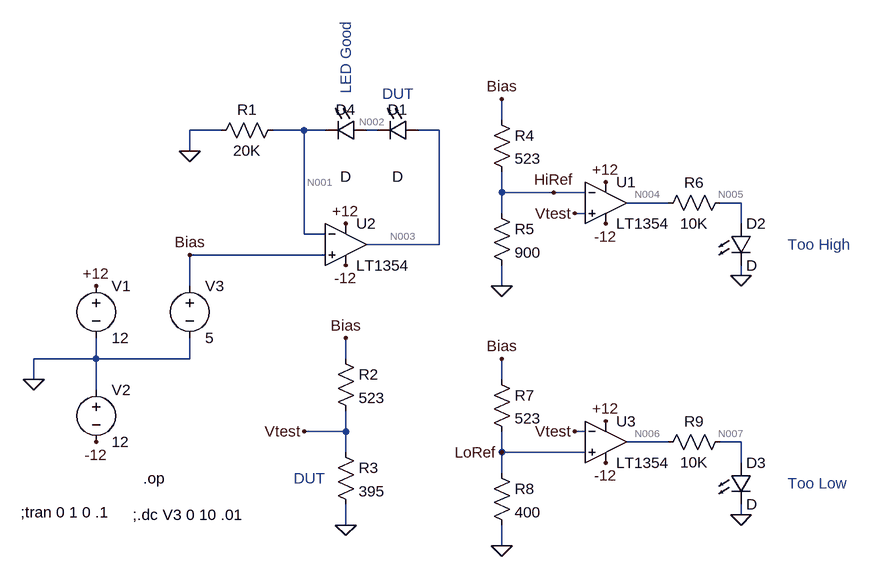
[diagram p0: schematic vactrol_test_rig.asc]
vactrol_test_rig.asc, the LTspice schematic file:
Version 4
SHEET 1 1456 680
WIRE 576 -224 576 -256
WIRE 144 -208 96 -208
WIRE 272 -208 224 -208
WIRE 304 -208 272 -208
WIRE 384 -208 368 -208
WIRE 480 -208 448 -208
WIRE 96 -176 96 -208
WIRE 576 -112 576 -144
WIRE 656 -112 576 -112
WIRE 704 -112 656 -112
WIRE 832 -96 768 -96
WIRE 944 -96 912 -96
WIRE 576 -80 576 -112
WIRE 704 -80 688 -80
WIRE 944 -64 944 -96
WIRE 272 -48 272 -208
WIRE 304 -48 272 -48
WIRE 480 -32 480 -208
WIRE 480 -32 368 -32
WIRE 304 -16 96 -16
WIRE 944 16 944 0
WIRE 96 32 96 -16
WIRE 576 32 576 0
WIRE -48 144 -48 112
WIRE -48 144 -144 144
WIRE 96 144 96 112
WIRE 96 144 -48 144
WIRE 336 144 336 112
WIRE -144 176 -144 144
WIRE 576 176 576 144
WIRE -48 192 -48 144
WIRE 336 256 336 224
WIRE 336 256 272 256
WIRE 704 256 688 256
WIRE 832 272 768 272
WIRE 944 272 912 272
WIRE 336 288 336 256
WIRE 576 288 576 256
WIRE 704 288 576 288
WIRE 944 304 944 272
WIRE 576 320 576 288
WIRE 944 384 944 368
WIRE 336 400 336 368
WIRE 576 432 576 400
FLAG -144 176 0
FLAG -48 32 +12
FLAG -48 272 -12
FLAG 336 -64 +12
FLAG 336 0 -12
FLAG 96 -176 0
FLAG 96 -16 Bias
FLAG 336 112 Bias
FLAG 336 400 0
FLAG 272 256 Vtest
FLAG 736 -128 +12
FLAG 736 -64 -12
FLAG 576 -256 Bias
FLAG 576 32 0
FLAG 688 -80 Vtest
FLAG 944 16 0
FLAG 736 240 +12
FLAG 736 304 -12
FLAG 576 144 Bias
FLAG 576 432 0
FLAG 688 256 Vtest
FLAG 944 384 0
FLAG 656 -112 HiRef
FLAG 576 288 LoRef
SYMBOL voltage -48 16 R0
WINDOW 123 0 0 Left 0
WINDOW 39 0 0 Left 0
SYMATTR InstName V1
SYMATTR Value 12
SYMBOL voltage -48 176 R0
WINDOW 123 0 0 Left 0
WINDOW 39 0 0 Left 0
SYMATTR InstName V2
SYMATTR Value 12
SYMBOL OpAmps\\LT1354 336 -96 R0
SYMATTR InstName U2
SYMBOL LED 448 -224 R90
WINDOW 0 0 32 VBottom 2
WINDOW 3 72 32 VTop 2
SYMATTR InstName D1
SYMBOL res 240 -224 R90
WINDOW 0 0 56 VBottom 2
WINDOW 3 32 56 VTop 2
SYMATTR InstName R1
SYMATTR Value 20K
SYMBOL voltage 96 16 R0
WINDOW 123 0 0 Left 0
WINDOW 39 0 0 Left 0
SYMATTR InstName V3
SYMATTR Value 5
SYMBOL res 320 128 R0
SYMATTR InstName R2
SYMATTR Value 523
SYMBOL res 320 272 R0
SYMATTR InstName R3
SYMATTR Value 395
SYMBOL OpAmps\\LT1354 736 -160 R0
SYMATTR InstName U1
SYMBOL res 560 -240 R0
SYMATTR InstName R4
SYMATTR Value 523
SYMBOL res 560 -96 R0
SYMATTR InstName R5
SYMATTR Value 900
SYMBOL res 928 -112 R90
WINDOW 0 0 56 VBottom 2
WINDOW 3 32 56 VTop 2
SYMATTR InstName R6
SYMATTR Value 10K
SYMBOL LED 928 -64 R0
SYMATTR InstName D2
SYMBOL OpAmps\\LT1354 736 208 R0
SYMATTR InstName U3
SYMBOL res 560 160 R0
SYMATTR InstName R7
SYMATTR Value 523
SYMBOL res 560 304 R0
SYMATTR InstName R8
SYMATTR Value 400
SYMBOL res 928 256 R90
WINDOW 0 0 56 VBottom 2
WINDOW 3 32 56 VTop 2
SYMATTR InstName R9
SYMATTR Value 10K
SYMBOL LED 928 304 R0
SYMATTR InstName D3
SYMBOL LED 368 -224 R90
WINDOW 0 0 32 VBottom 2
WINDOW 3 72 32 VTop 2
SYMATTR InstName D4
TEXT 8 384 Left 2 !;.dc V3 0 10 .01
TEXT -164 380 Left 2 !;tran 0 1 0 .1
TEXT 24 328 Left 2 !.op
TEXT 1016 -32 Left 2 ;Too High
TEXT 1016 336 Left 2 ;Too Low
TEXT 256 328 Left 2 ;DUT
TEXT 392 -264 Left 2 ;DUT
TEXT 336 -264 VLeft 2 ;LED Good

The netlist it stands for:
* vactrol_test_rig.asc
V1 +12 0 12
V2 0 -12 12
XU2 Bias N001 +12 -12 N003 LT1354  ; pins In+ In- V+ V- OUT
D1 N003 N002 D
R1 N001 0 20K
V3 Bias 0 5
R2 Bias Vtest 523
R3 Vtest 0 395
XU1 Vtest HiRef +12 -12 N004 LT1354  ; pins In+ In- V+ V- OUT
R4 Bias HiRef 523
R5 HiRef 0 900
R6 N005 N004 10K
D2 N005 0 D
XU3 LoRef Vtest +12 -12 N006 LT1354  ; pins In+ In- V+ V- OUT
R7 Bias LoRef 523
R8 LoRef 0 400
R9 N007 N006 10K
D3 N007 0 D
D4 N002 N001 D
.model D D
.lib standard.dio
;.dc V3 0 10 .01
;tran 0 1 0 .1
.op
* Too High
* Too Low
* DUT
* DUT
* LED Good
.backanno
.end

* Results of the author's LTspice run, read from the files saved beside the schematic
* Operating Point:
*   V(+12) = 12 V
*   V(-12) = -12 V
*   V(n001) = 5 V
*   V(bias) = 5 V
*   V(n003) = 6.238 V
*   V(n002) = 5.619 V
*   V(vtest) = 2.151 V
*   V(hiref) = 3.162 V
*   V(n004) = -11.19 V
*   V(n005) = -11.19 V
*   V(loref) = 2.167 V
*   V(n006) = 11.09 V
*   V(n007) = 656.2 mV
*   I(D4) = 250.1 µA
*   I(D3) = 1.044 mA
*   I(D2) = -11.2 pA
*   I(D1) = 250.1 µA
*   I(R9) = -1.044 mA
*   I(R8) = 5.417 mA
*   I(R7) = 5.417 mA
*   I(R6) = 11.2 pA
*   I(R5) = 3.514 mA
*   I(R4) = 3.514 mA
*   I(R3) = 5.447 mA
*   I(R2) = 5.447 mA
*   I(R1) = 250 µA
*   I(V3) = -14.38 mA
*   I(V2) = -2.408 mA
*   I(V1) = -3.702 mA
*   Ix(u2:1) = 111.9 nA
*   Ix(u2:2) = 111.8 nA
*   Ix(u2:3) = 1.123 mA
*   Ix(u2:4) = -873.2 µA
*   Ix(u2:5) = -250.1 µA
*   Ix(u1:1) = 2.149 nA
*   Ix(u1:2) = 192.3 nA
*   Ix(u1:3) = 994.1 µA
*   Ix(u1:4) = -994.3 µA
*   Ix(u1:5) = 33.57 pA
*   Ix(u3:1) = 95.55 nA
*   Ix(u3:2) = 92.64 nA
*   Ix(u3:3) = 1.584 mA
*   Ix(u3:4) = -541 µA
*   Ix(u3:5) = -1.044 mA
* From the log:
*   Semiconductor Device Operating Points:
*                           --- Diodes ---
*   Name:    d:u3:4      d:u3:2      d:u3:1      d:u3:6      d:u3:5
*   Model:  u3:dbias    u3:dbias      u3:ds       u3:yd       u3:yu
*   Id:      8.06e-08    8.06e-08   -4.63e-12   -3.70e-14    3.70e-14
*   Vd:      1.42e+01    1.42e+01   -4.63e-03   -3.70e-02    3.70e-02
*   Req:     1.00e-06    1.00e-06    1.00e-09    1.00e-12    1.00e-12
*   CAP:     0.00e+00    0.00e+00    0.00e+00    0.00e+00    0.00e+00
*   Name:    d:u1:4      d:u1:2      d:u1:1      d:u1:6      d:u1:5
*   Model:  u1:dbias    u1:dbias      u1:ds       u1:yd       u1:yu
*   Id:      8.06e-08    8.06e-08    1.03e-07    1.99e-21   -1.99e-21
*   Vd:      1.42e+01    1.52e+01    2.00e-01    1.98e-09   -1.98e-09
*   Req:     1.00e-06    1.00e-06    1.00e-02    1.00e-12    1.00e-12
*   CAP:     0.00e+00    0.00e+00    0.00e+00    0.00e+00    0.00e+00
*   Name:      d4          d3          d2          d1        d:u2:4
*   Model:      d           d           d           d       u2:dbias
*   Id:      2.50e-04    1.04e-03   -1.12e-11    2.50e-04    8.06e-08
*   Vd:      6.19e-01    6.56e-01   -1.12e+01    6.19e-01    1.70e+01
*   Req:     1.03e+02    2.48e+01    1.00e+12    1.03e+02    1.00e-06
*   CAP:     0.00e+00    0.00e+00    0.00e+00    0.00e+00    0.00e+00
*   Name:    d:u2:2      d:u2:1      d:u2:6      d:u2:5
*   Model:  u2:dbias      u2:ds       u2:yd       u2:yu
*   Id:      8.06e-08   -5.20e-14   -8.88e-15    8.88e-15
*   Vd:      1.70e+01   -5.20e-05   -8.87e-03    8.87e-03
*   Req:     1.00e-06    1.00e-09    1.00e-12    1.00e-12
*   CAP:     0.00e+00    0.00e+00    0.00e+00    0.00e+00
*                           --- VDMOSFET Transistors ---
*   Name:        m:u3:2      m:u3:1      m:u1:2      m:u1:1      m:u2:2
*   Model:        u3:p        u3:n        u1:p        u1:n        u2:p
*   Id:         -5.41e-04    1.58e-03   -9.94e-04    9.94e-04   -8.73e-04
*   Vgs:         3.70e-02    3.70e-02   -1.98e-09   -1.98e-09    8.87e-03
*   Vds:        -2.31e+01    9.08e-01   -8.13e-01    2.32e+01   -1.82e+01
*   Vth:         1.41e-01   -1.41e-01    1.41e-01   -1.41e-01    1.41e-01
*   Gm:          1.04e-02    1.78e-02    1.41e-02    1.41e-02    1.32e-02
*   Gds:         0.00e+00    0.00e+00    0.00e+00    0.00e+00    0.00e+00
*   Cgs:         0.00e+00    0.00e+00    0.00e+00    0.00e+00    0.00e+00
*   Cgd:         0.00e+00    0.00e+00    0.00e+00    0.00e+00    0.00e+00
*   Cbody:       0.00e+00    0.00e+00    0.00e+00    0.00e+00    0.00e+00
*   Name:        m:u2:1
*   Model:        u2:n
*   Id:          1.12e-03
*   Vgs:         8.87e-03
*   Vds:         5.76e+00
*   Vth:        -1.41e-01
*   Gm:          1.50e-02
*   Gds:         0.00e+00
*   Cgs:         0.00e+00
*   Cgd:         0.00e+00
*   Cbody:       0.00e+00